# Altium schematic sheet RJ45.SchDoc
size A; SheetNumber: 6; SheetTotal: 7
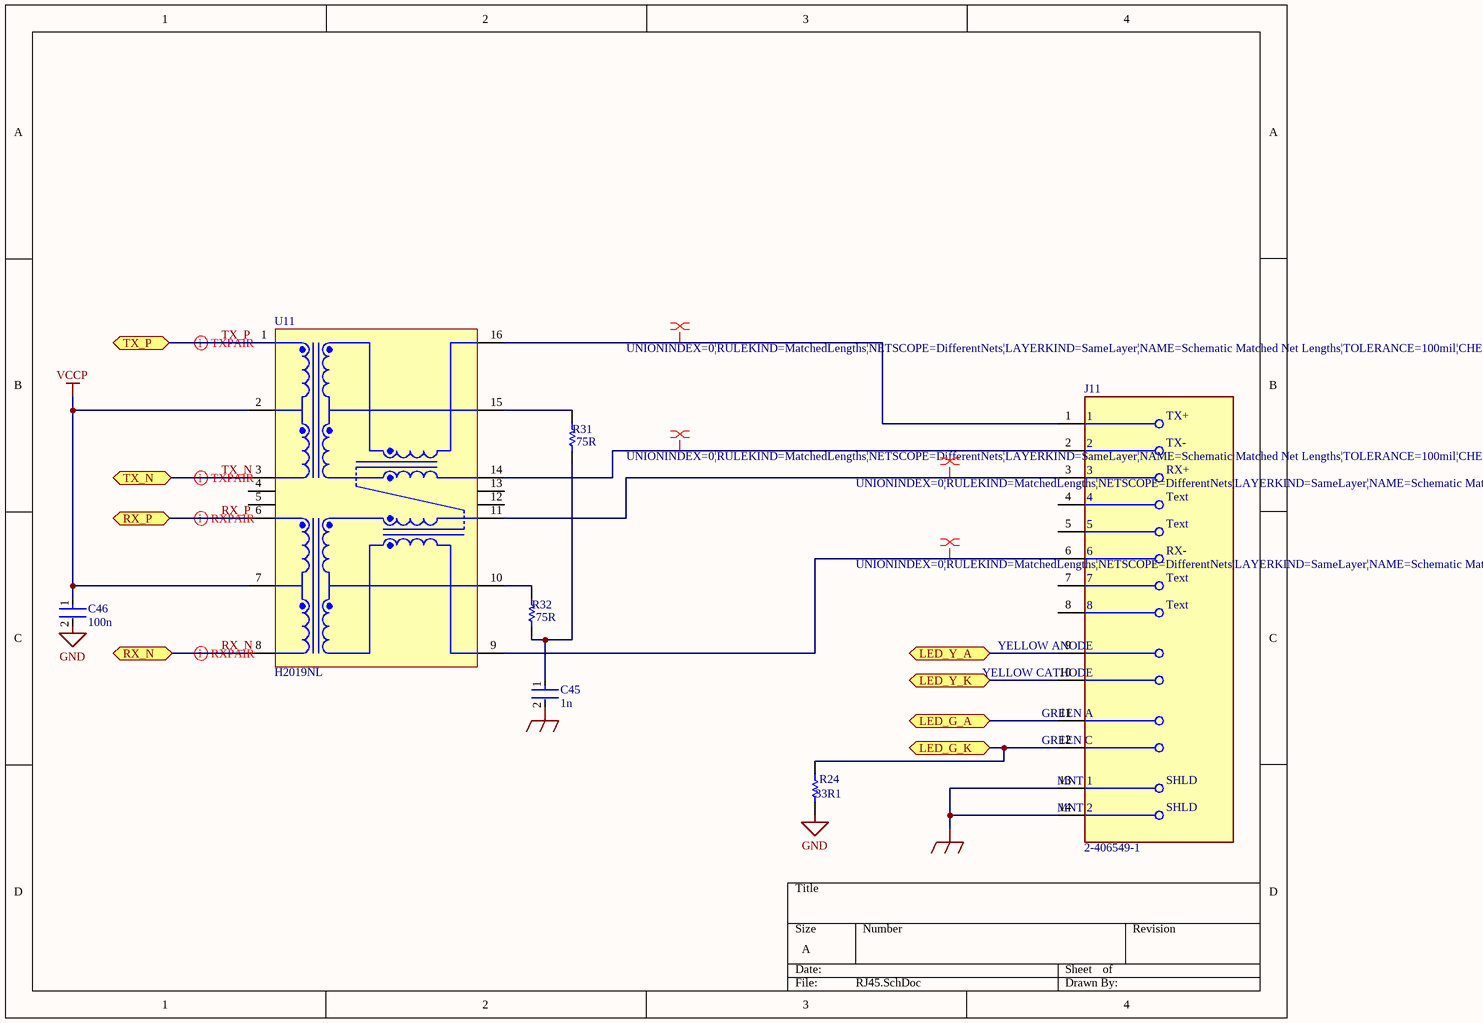
[diagram p0: RJ45.SchDoc]

## Parts
C45  1n  [FP-GRM033-0_03-MFG]
C46  100n  [FP-GRM033-0_03-MFG]
J11  2-406549-1  [FP-2-406549-1-MFG]
R24  33R1  [RESC1608X55X30LL20T20]
R31  75R  [RESC1608X55X30LL20T20]
R32  75R  [RESC1608X55X30LL20T20]
U11  H2019NL  [PULS-H2019FNL_V]

## Ports
LED_G_A (bidir, see ETH[4B]), LED_G_K (bidir), LED_Y_A (bidir, see ETH[4B]), LED_Y_K (bidir, see ETH[4B]), RX_N (bidir, see ETH[3B]), RX_P (bidir, see ETH[4B]), TX_N (bidir, see ETH[3B]), TX_P (bidir, see ETH[4B])

## Nets
GND: C45.2 C46.2 J11.13(MNT_1) J11.14(MNT_2) R24.1
VCCP: C46.1 U11.2(TCT) U11.7(RCT)
LED_G_A: J11.11(GREEN_A) ; port LED_G_A
LED_G_K: J11.12(GREEN_C) R24.2 ; port LED_G_K
LED_Y_A: J11.9(YELLOW_ANODE) ; port LED_Y_A
LED_Y_K: J11.10(YELLOW_CATHODE) ; port LED_Y_K
RX_N: U11.8(RD-) ; port RX_N
RX_P: U11.6(RD+) ; port RX_P
TX_N: U11.3(TD-) ; port TX_N
TX_P: U11.1(TD+) ; port TX_P
NetC45_1: C45.1 R31.1 R32.1
NetJ11_1: J11.1 U11.16(TX+)
NetJ11_2: J11.2 U11.14(TX-)
NetJ11_3: J11.3 U11.11(RX+)
NetJ11_6: J11.6 U11.9(RX-)
NetR31_2: R31.2 U11.15(TXCT)
NetR32_2: R32.2 U11.10(RXCT)

Not connected (* = marked no-connect by the designer): J11 4 5 7 8; U11 4(NC) 5(NC) 12(NC) 13(NC)

## Layout directives
differential pair: RX_N, RX_P, TX_N, TX_P
rule Matched Net Lengths [Tolerance = 100mil]; rule Differential Pairs Routing [Pref Gap = 10mil    Min Gap  = 10mil    Max Gap  = 10milPref Width = 15mil    Min Width  = 15mil    Max Width  = 15mil]: NetJ11_1, NetJ11_2, NetJ11_3, NetJ11_6

## Notes on the sheet
- TX+
- TX-
- RX+
- Text
- RX-
- SHLD

## Library data of the parts
C45 C46 = CMP-06035-000062-2: Chip Multilayer Ceramic Capacitors for General Purpose, 0201, 0.10uF, X5R, 15%, 10%, 6.3V; Capacitance: 100nF; Min Operating Temperature: -55°C; Lead Free: Lead Free; Radiation Hardening: No; Dielectric: X5R; Voltage Rating (DC): 6.3V; REACH SVHC: No SVHC; Case/Package: 0201; Voltage Rating: 6.3V; Length: 0.6mm; Max Operating Temperature: 85°C; Width: 0.012inch; Depth: 0.3mm; Material: Ceramic; Case Code (Metric): 0603; Thickness: 0.013inch; Packaging: Tape and Reel; Height: 0.3mm; Weight: 6E-06oz; Package Quantity: 1; Mount: Surface Mount; Voltage: 6.3V; Case Code (Imperial): 0201; Tolerance: 10%; Termination: SMD/SMT
J11 = CMP-2000-05541-2: CONN MOD JACK 8P8C R/A SHIELDED; Max Voltage Rating (AC): 150V; Number of Contacts: 8; PCB Mounting Orientation: Right Angle; Direction: Up; Pitch: 2.03mm; Number of Ports: 1; Gender: Female; Tail Length: 2.54mm; Current Rating: 1.5A; Keyed: No; Approvals: UL; PCB Thickness: 1.57mm; Element Configuration: Single; Connector Type: Jack; Color: Yellow; Max Operating Temperature: 85°C; Weight: 0.144729oz; Series: -; Orientation: Right Angle; Width: 17.27mm; Package Quantity: 63; Mount: Panel; Contact Plating: Gold; Length: 17.86mm; Depth: 15.75mm; Flammability Rating: UL94 V-0; Shielding: Shielded; Housing Material: Thermoplastic; Number of Positions Loaded: 8; Contact Material: Bronze; Voltage Rating: 150V; Packaging: Tray; Number of Positions: 8; Termination: Solder; Number of Rows: 1; Radiation Hardening: No; Min Operating Temperature: -40°C; RoHS Compliant: Yes; Housing Color: Black
R24 R31 R32 = CMP-2000-00025-1: Part Number: ERA3AEB301V; Manufacturer: Panasonic
U11 = CMP-2000-06384-1: Telecom Transformer, 100BASE-TX, 0 to 70 degC, 16-Pin SMD, RoHS; Manufacturer: Pulse Electronics; Other Names: 553-2199; Other Related Documents: PackagesFNLvs.NL; Mounting Technology: SurfaceMount; Manufacturer URL: http://www.pulseelectronics.com/; Package Description: 16-Pin Surface Mount Device, Body 12.7 x 9.09 mm, Pitch 1.27 mm; Package Reference: H2019FNL; Standard Package: 40; Datasheet Version: Rev. A, 06/2014; Category: Transformers; Family: PulseTransformers; Datasheet URL: http://productfinder.pulseeng.com/products/datasheets/H2019FNL.pdf